# Altium schematic sheet Cover_Page.SchDoc: Cover Page
size Tabloid; DrawnBy: Dhrumil Parikh; SheetNumber: 1; SheetTotal: 3; PageSetup: Record=PageOptions|CenterHorizontal=True|CenterVertical=True|PrintScale=0.62|XCorrection=1.00|YCorrection=1.00|PrintKind=1|BorderSize=5000000|LeftOffset=0|BottomOffset=0|Orientation=2|PaperLength=1000|PaperWidth=1000|Scale=100|PaperSource=7|PrintQuality=600|MediaType=1|DitherType=10|PaperKind=Letter|PrintScaleMode=1; PageSize: T
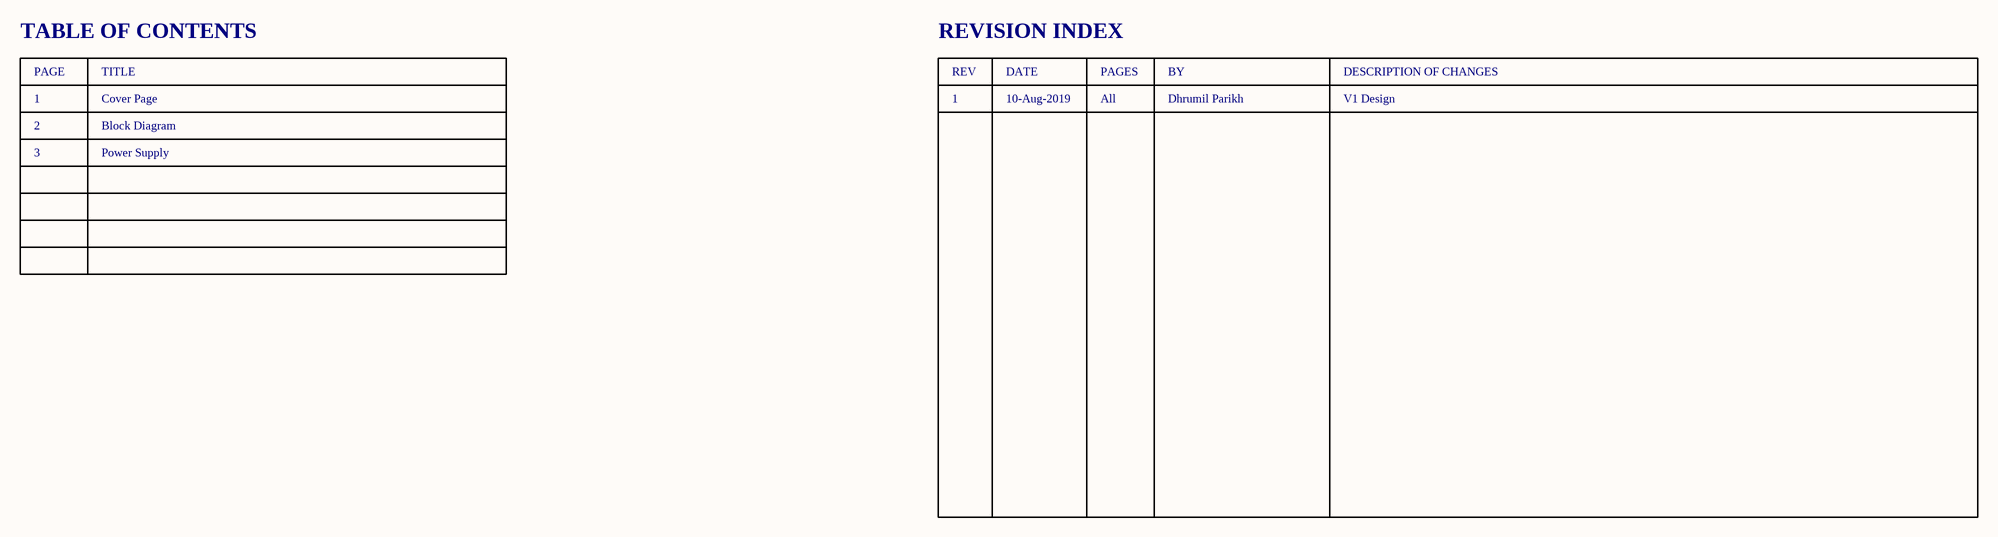
[diagram p0: Cover_Page.SchDoc]

## Notes on the sheet
- TABLE OF CONTENTS
- REVISION INDEX
- PAGE
- 1
- 2
- TITLE
- Cover Page
- Block Diagram
- REV
- DATE
- 10-Aug-2019
- PAGES
- All
- BY
- Dhrumil Parikh
- DESCRIPTION OF CHANGES
- V1 Design
- 3
- Power Supply
- Title:
- Project:
- Size:
- Date:
- By:
- Rev:
- Sheet
- of
- File: